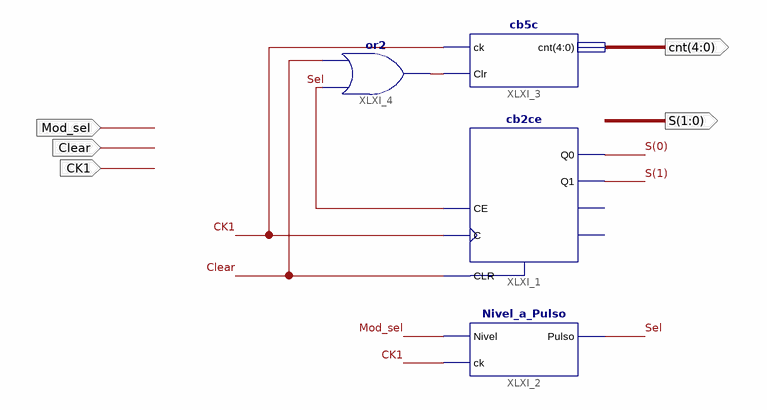
[diagram p0: schematic sheet 1]
// Xilinx ISE schematic Ctrl.sch (spartan6) as structural Verilog: 4 symbols, 5 ports
module Ctrl (
  input  Mod_sel,
  input  CK1,
  input  Clear,
  output [4:0] cnt,
  output [1:0] S
);

  wire Sel, XLXN_1;

  cb2ce XLXI_1 (.C(CK1), .CE(Sel), .CLR(Clear), .Q0(S[0]), .Q1(S[1]));  // open: CEO, TC
  Nivel_a_Pulso XLXI_2 (.ck(CK1), .Nivel(Mod_sel), .Pulso(Sel));
  cb5c XLXI_3 (.ck(CK1), .Clr(XLXN_1), .cnt(cnt));
  or XLXI_4 (XLXN_1, Sel, Clear);
endmodule
